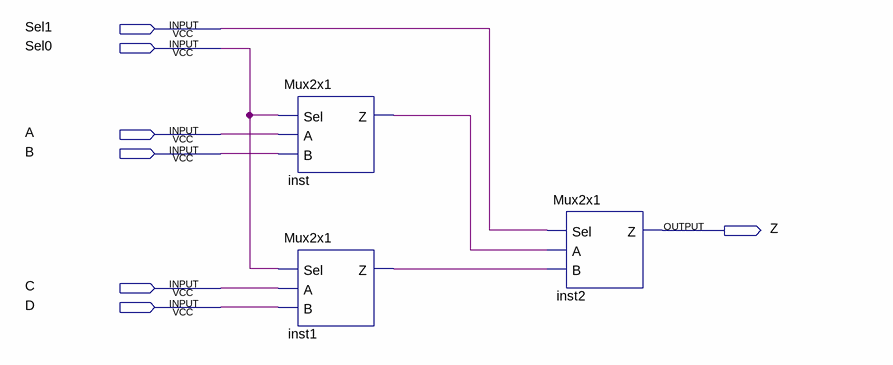
[diagram p0: schematic sheet]
// Quartus schematic Mux4x1.bdf as structural Verilog: 3 symbols, 7 pins
module Mux4x1 (
  input  Sel1,
  input  Sel0,
  input  A,
  input  B,
  input  C,
  input  D,
  output Z
);

  wire inst1_z, inst_z;

  Mux2x1 inst (.Sel(Sel0), .A(A), .B(B), .Z(inst_z));
  Mux2x1 inst1 (.Sel(Sel0), .A(C), .B(D), .Z(inst1_z));
  Mux2x1 inst2 (.Sel(Sel1), .A(inst_z), .B(inst1_z), .Z(Z));
endmodule
